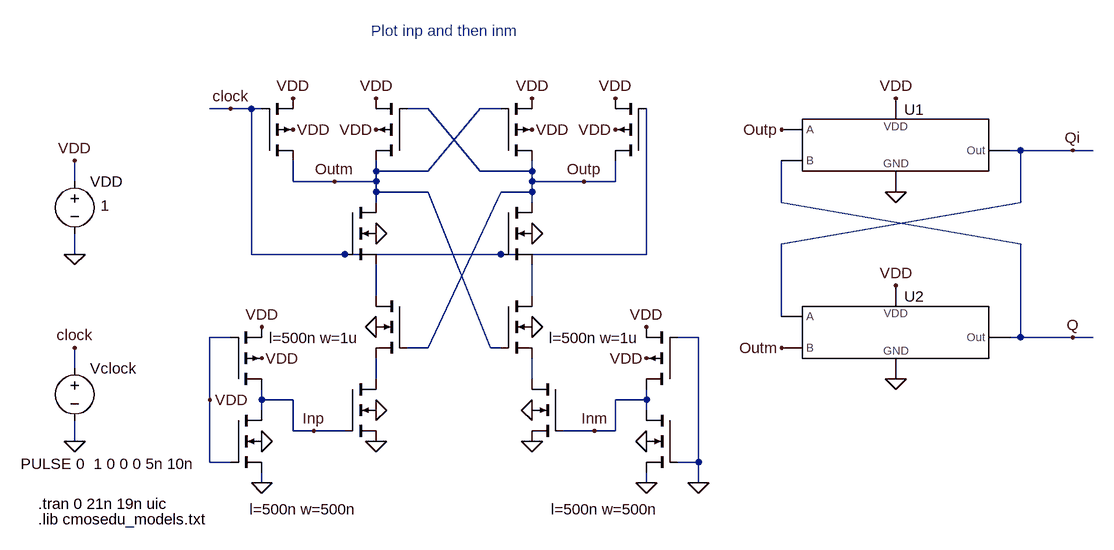
[diagram p0: schematic Fig16_37.asc]
Fig16_37.asc, the LTspice schematic file:
Version 4
SHEET 1 1828 680
WIRE 256 -448 256 -480
WIRE 256 -336 256 -368
WIRE 256 -160 256 -192
WIRE 256 -48 256 -80
WIRE 464 -112 464 -208
WIRE 464 -16 464 -112
WIRE 496 -560 464 -560
WIRE 496 -208 464 -208
WIRE 496 -16 464 -16
WIRE 528 -560 496 -560
WIRE 528 -336 528 -560
WIRE 544 -560 528 -560
WIRE 544 -112 544 -128
WIRE 544 -96 544 -112
WIRE 544 16 544 0
WIRE 592 -448 592 -480
WIRE 592 -112 544 -112
WIRE 592 -64 592 -112
WIRE 624 -64 592 -64
WIRE 656 -448 592 -448
WIRE 672 -336 528 -336
WIRE 672 -64 624 -64
WIRE 720 -464 720 -480
WIRE 720 -448 656 -448
WIRE 720 -448 720 -464
WIRE 720 -432 720 -448
WIRE 720 -416 720 -432
WIRE 720 -272 720 -320
WIRE 720 -144 720 -176
WIRE 800 -560 768 -560
WIRE 800 -464 720 -464
WIRE 800 -432 720 -432
WIRE 800 -192 768 -192
WIRE 880 -560 800 -464
WIRE 880 -464 800 -560
WIRE 896 -192 800 -432
WIRE 912 -560 880 -560
WIRE 912 -432 800 -192
WIRE 912 -336 672 -336
WIRE 912 -192 896 -192
WIRE 960 -464 880 -464
WIRE 960 -464 960 -480
WIRE 960 -448 960 -464
WIRE 960 -432 912 -432
WIRE 960 -432 960 -448
WIRE 960 -416 960 -432
WIRE 960 -272 960 -320
WIRE 960 -144 960 -176
WIRE 1040 -448 960 -448
WIRE 1056 -64 1008 -64
WIRE 1088 -448 1040 -448
WIRE 1088 -448 1088 -480
WIRE 1088 -64 1056 -64
WIRE 1088 -64 1088 -112
WIRE 1136 -336 912 -336
WIRE 1136 -336 1136 -560
WIRE 1136 -112 1088 -112
WIRE 1136 -112 1136 -128
WIRE 1136 -96 1136 -112
WIRE 1136 16 1136 0
WIRE 1216 -208 1184 -208
WIRE 1216 -16 1184 -16
WIRE 1216 -16 1216 -208
WIRE 1216 16 1216 -16
WIRE 1344 -416 1344 -480
WIRE 1344 -240 1344 -352
WIRE 1712 -496 1696 -496
WIRE 1712 -416 1344 -352
WIRE 1712 -416 1712 -496
WIRE 1712 -352 1344 -416
WIRE 1712 -208 1696 -208
WIRE 1712 -208 1712 -352
WIRE 1792 -496 1712 -496
WIRE 1792 -208 1712 -208
WIRE 1824 -496 1792 -496
WIRE 1824 -208 1792 -208
FLAG 720 -96 0
FLAG 256 -336 0
FLAG 256 -480 VDD
FLAG 720 -528 VDD
FLAG 960 -528 VDD
FLAG 720 -576 VDD
FLAG 960 -576 VDD
FLAG 960 -224 0
FLAG 720 -224 0
FLAG 256 -48 0
FLAG 256 -192 clock
FLAG 592 -528 VDD
FLAG 592 -576 VDD
FLAG 1088 -528 VDD
FLAG 1088 -576 VDD
FLAG 720 -368 0
FLAG 960 -368 0
FLAG 496 -560 clock
FLAG 720 -48 0
FLAG 960 -96 0
FLAG 960 -48 0
FLAG 624 -64 Inp
FLAG 1056 -64 Inm
FLAG 1040 -448 Outp
FLAG 656 -448 Outm
FLAG 1520 -432 0
FLAG 1520 -144 0
FLAG 1520 -576 VDD
FLAG 1520 -288 VDD
FLAG 1792 -208 Q
FLAG 1792 -496 Qi
FLAG 1344 -528 Outp
FLAG 1344 -192 Outm
FLAG 544 -176 VDD
FLAG 544 -224 VDD
FLAG 544 -48 0
FLAG 544 16 0
FLAG 464 -112 VDD
FLAG 1136 -176 VDD
FLAG 1136 -224 VDD
FLAG 1136 -48 0
FLAG 1136 16 0
FLAG 1216 16 0
SYMBOL nmos4 672 -144 R0
WINDOW 0 104 24 Invisible 0
WINDOW 3 179 41 Invisible 0
SYMATTR InstName M1
SYMATTR Value N_50n
SYMATTR Value2 l=50n w=500n
SYMBOL voltage 256 -464 R0
WINDOW 123 0 0 Left 0
WINDOW 39 0 0 Left 0
WINDOW 3 40 53 Left 0
SYMATTR Value 1
SYMATTR InstName VDD
SYMBOL pmos4 768 -480 R180
WINDOW 0 56 32 Invisible 0
WINDOW 3 56 72 Invisible 0
SYMATTR InstName M2
SYMATTR Value P_50n
SYMATTR Value2 l=50n w=1u
SYMBOL pmos4 912 -480 M180
WINDOW 0 56 32 Invisible 0
WINDOW 3 56 72 Invisible 0
SYMATTR InstName M3
SYMATTR Value P_50n
SYMATTR Value2 l=50n w=1u
SYMBOL nmos4 912 -272 R0
WINDOW 0 104 24 Invisible 0
WINDOW 3 179 41 Invisible 0
SYMATTR InstName M5
SYMATTR Value N_50n
SYMATTR Value2 l=50n w=500n
SYMBOL nmos4 768 -272 M0
WINDOW 0 104 24 Invisible 0
WINDOW 3 179 41 Invisible 0
SYMATTR InstName M6
SYMATTR Value N_50n
SYMATTR Value2 l=50n w=500n
SYMBOL voltage 256 -176 R0
WINDOW 123 0 0 Left 0
WINDOW 39 0 0 Left 0
WINDOW 3 -83 163 Left 0
SYMATTR Value PULSE 0  1 0 0 0 5n 10n
SYMATTR InstName Vclock
SYMBOL pmos4 544 -480 M180
WINDOW 0 56 32 Invisible 0
WINDOW 3 56 72 Invisible 0
SYMATTR InstName M4
SYMATTR Value P_50n
SYMATTR Value2 l=50n w=1u
SYMBOL pmos4 1136 -480 R180
WINDOW 0 56 32 Invisible 0
WINDOW 3 56 72 Invisible 0
SYMATTR InstName M7
SYMATTR Value P_50n
SYMATTR Value2 l=50n w=1u
SYMBOL nmos4 672 -416 R0
WINDOW 0 104 24 Invisible 0
WINDOW 3 179 41 Invisible 0
SYMATTR InstName M8
SYMATTR Value N_50n
SYMATTR Value2 l=50n w=500n
SYMBOL nmos4 912 -416 R0
WINDOW 0 104 24 Invisible 0
WINDOW 3 179 41 Invisible 0
SYMATTR InstName M9
SYMATTR Value N_50n
SYMATTR Value2 l=50n w=500n
SYMBOL nmos4 1008 -144 M0
WINDOW 0 104 24 Invisible 0
WINDOW 3 179 41 Invisible 0
SYMATTR InstName M10
SYMATTR Value N_50n
SYMATTR Value2 l=50n w=500n
SYMBOL NAND_2 1296 -480 R0
SYMATTR InstName U1
SYMBOL NAND_2 1296 -192 R0
SYMATTR InstName U2
SYMBOL pmos4 496 -128 M180
WINDOW 0 56 32 Invisible 0
WINDOW 3 56 72 Invisible 0
WINDOW 123 59 79 Left 0
SYMATTR InstName M11
SYMATTR Value P_50n
SYMATTR Value2 l=500n w=1u
SYMBOL nmos4 496 -96 R0
WINDOW 0 104 24 Invisible 0
WINDOW 3 179 41 Invisible 0
WINDOW 123 29 153 Left 0
SYMATTR InstName M12
SYMATTR Value N_50n
SYMATTR Value2 l=500n w=500n
SYMBOL pmos4 1184 -128 R180
WINDOW 0 56 32 Invisible 0
WINDOW 3 56 72 Invisible 0
WINDOW 123 59 79 Left 0
SYMATTR InstName M13
SYMATTR Value P_50n
SYMATTR Value2 l=500n w=1u
SYMBOL nmos4 1184 -96 M0
WINDOW 0 104 24 Invisible 0
WINDOW 3 179 41 Invisible 0
WINDOW 123 29 153 Left 0
SYMATTR InstName M14
SYMATTR Value N_50n
SYMATTR Value2 l=500n w=500n
TEXT 200 72 Left 0 !.lib cmosedu_models.txt
TEXT 200 48 Left 0 !.tran 0 21n 19n uic
TEXT 712 -680 Left 0 ;Plot inp and then inm

The netlist it stands for:
* Fig16_37.asc
M1 N002 Inp 0 0 N_50n l=50n w=500n
VDD VDD 0 1
M2 Outm Outp VDD VDD P_50n l=50n w=1u
M3 Outp Outm VDD VDD P_50n l=50n w=1u
M5 N003 Outm N004 0 N_50n l=50n w=500n
M6 N001 Outp N002 0 N_50n l=50n w=500n
Vclock clock 0 PULSE 0  1 0 0 0 5n 10n
M4 Outm clock VDD VDD P_50n l=50n w=1u
M7 Outp clock VDD VDD P_50n l=50n w=1u
M8 Outm clock N001 0 N_50n l=50n w=500n
M9 Outp clock N003 0 N_50n l=50n w=500n
M10 N004 Inm 0 0 N_50n l=50n w=500n
XU1 Outp Q Qi VDD 0 NAND_2  ; pins A B Out VDD GND
XU2 Qi Outm Q VDD 0 NAND_2  ; pins A B Out VDD GND
M11 Inp VDD VDD VDD P_50n l=500n w=1u
M12 Inp VDD 0 0 N_50n l=500n w=500n
M13 Inm 0 VDD VDD P_50n l=500n w=1u
M14 Inm 0 0 0 N_50n l=500n w=500n
.model NMOS NMOS
.model PMOS PMOS
.lib standard.mos
.lib cmosedu_models.txt
.tran 0 21n 19n uic
* Plot inp and then inm
.backanno
.end